# Altium schematic sheet HELIALights2022V1.0Sheet1.SchDoc: HELIA Lights
size A3; Author: Jeremias Pohle; CompanyName: CUER; DrawnBy: Jeremias Pohle; Engineer: Jeremias Pohle; Organization: University of Cambridge; Revision: 1.0; SheetNumber: 1; SheetTotal: 2
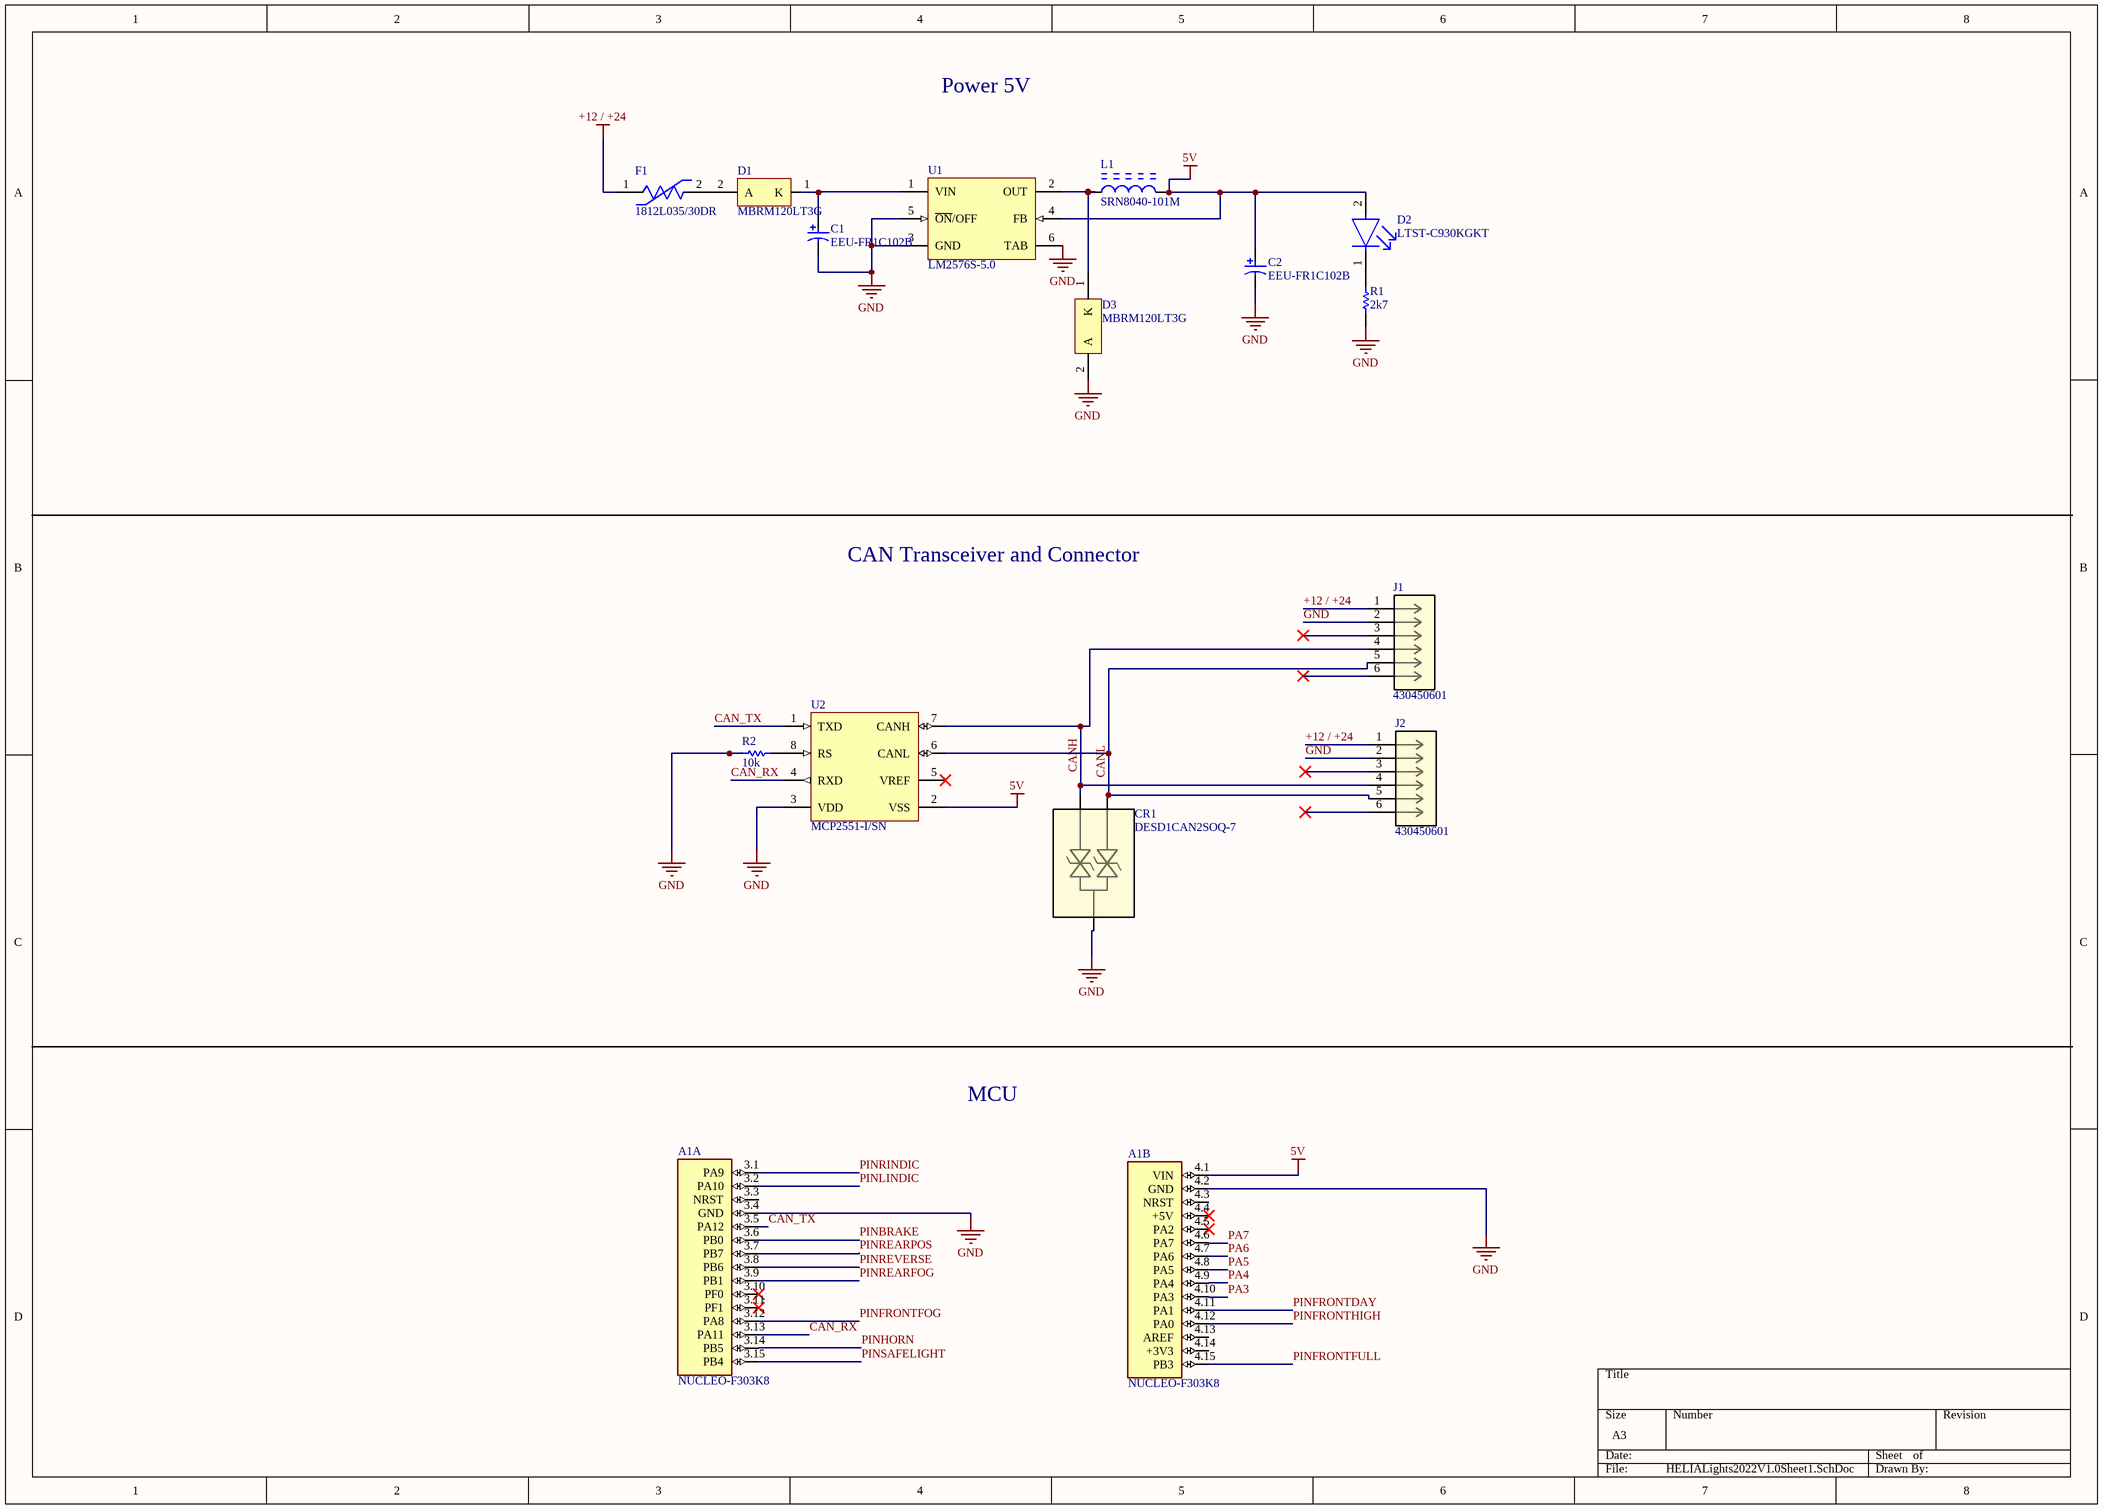
[diagram p0: HELIALights2022V1.0Sheet1.SchDoc]

## Parts
A1  NUCLEO-F303K8  [MODULE_NUCLEO-F303K8]  (parts A,B of 2)
C1  EEU-FR1C102B  [PNSC-EEUFM1H221-2]
C2  EEU-FR1C102B  [PNSC-EEUFM1H221-2]
CR1  DESD1CAN2SOQ-7  [DIODE3_DESD1CAN2SOQ-7_DIO]
D1  MBRM120LT3G  [ONSC-POWERMITE-2-457-04_D_V]
D2  LTST-C930KGKT  [FP-LTST-C930KGKT-MFG]
D3  MBRM120LT3G  [ONSC-POWERMITE-2-457-04_D_V]
F1  1812L035/30DR  [FP-1812L035-30DR-MFG]
J1  430450601  [CON_430450601_MOL]
J2  430450601  [CON_430450601_MOL]
L1  SRN8040-101M  [BOUR-SRN8040-101M_V]
R1  2k7  [RESC1609X50X30NL8T20]
R2  10k  [RESC1609X50X30NL8T20]
U1  LM2576S-5.0  [KTT0005B_N]
U2  MCP2551-I/SN  [MCHP-SN8_V]

## Nets
5V: A1.4.1(VIN) C2.1 D2.2(A) L1.2 U1.4(FB) U2.2(VSS)
+12 / +24: F1.1 J1.1 J2.1
GND: A1.3.4(GND) A1.4.2(GND) C1.2 C2.2 CR1.3 D3.2(A) J1.2 J2.2 R1.1 R2.2 U1.3(GND) U1.5(~{ON}/OFF) U1.6(TAB) U2.3(VDD)
CAN_RX: A1.3.13(PA11) U2.4(RXD)
CAN_TX: A1.3.5(PA12) U2.1(TXD)
CANH: CR1.2 J1.4 J2.4 U2.7(CANH)
CANL: CR1.1 J1.5 J2.5 U2.6(CANL)
PA3: A1.4.10(PA3)
PA4: A1.4.9(PA4)
PA5: A1.4.8(PA5)
PA6: A1.4.7(PA6)
PA7: A1.4.6(PA7)
PINBRAKE: A1.3.6(PB0)
PINFRONTDAY: A1.4.11(PA1)
PINFRONTFOG: A1.3.12(PA8)
PINFRONTFULL: A1.4.15(PB3)
PINFRONTHIGH: A1.4.12(PA0)
PINHORN: A1.3.14(PB5)
PINLINDIC: A1.3.2(PA10)
PINREARFOG: A1.3.9(PB1)
PINREARPOS: A1.3.7(PB7)
PINREVERSE: A1.3.8(PB6)
PINRINDIC: A1.3.1(PA9)
PINSAFELIGHT: A1.3.15(PB4)
NetC1_1: C1.1 D1.1(K) U1.1(VIN)
NetD1_2: D1.2(A) F1.2
NetD2_1: D2.1(C) R1.2
NetD3_1: D3.1(K) L1.1 U1.2(OUT)
NetR2_1: R2.1 U2.8(RS)

Not connected (* = marked no-connect by the designer): A1 3.3(NRST) 3.10(PF0)* 3.11(PF1)* 4.3(NRST) 4.4(+5V)* 4.5(PA2)* 4.13(AREF) 4.14(+3V3); J1 3* 6*; J2 3* 6*; U2 5(VREF)*

## Notes on the sheet
- Power 5V
- CAN Transceiver and Connector
- MCU

## Library data of the parts
A1 = NUCLEO-F303K8: STM32F303K8, mbed-Enabled Development Nucleo-32 STM32F3 ARMÂ® CortexÂ®-M4 MCU 32-Bit Embedded Evaluation Board; MF: STMicroelectronics; MP: NUCLEO-F303K8; SnapEDA_Link: https://www.snapeda.com/parts/NUCLEO-F303K8/STMicroelectronics/view-part/276791/?ref=snap; Availability: Unavailable; Package: None; Value: *; Price: None
C1 C2 = CMP-2000-05313-1: Aluminum Electrolytic Capacitor, 1000 uF, +/- 20%, 16 V, -40 to 105 degC, 2-Pin THD, RoHS, Tape and Reel; Manufacturer: Panasonic; Capacitance: 1000µF; Ripple Current: 1790mA; Rated Voltage: 16V; Impedance: 0.028O; Type: Radial; Lifetime@Temperature: 8000Hrs@105degC; Operating Temp-Max: 105degC; Operating Temp Range: -40to+105degC; Manufacturer URL: http://www.panasonic.com/; Datasheet URL: http://www.produktinfo.conrad.com/datenblaetter/425000-449999/446746-da-01-en-ALU_KONDENSATOR_FR_R_1000_UF_16V.pdf; Case Size/Dimension: Ø10x16mm; Datasheet Version: Nov-11; Series: FR
CR1 = DESD1CAN2SOQ-7: No Description Available; Mfr_Name: Diodes Inc; Type: DEV; Copyright: Copyright (C) 2022 Ultra Librarian. All rights reserved.; Manufacturer_Part_Number: DESD1CAN2SOQ-7; RefDes: RefDes
D1 D3 = CMP-1055-00263-1: Schottky Power Rectifier, 2-Pin Powermite, Pb-Free, Tape and Reel; PartNumber: MBRM120LT1G; Manufacturer: On Semiconductor; IFSM Max (A): 50; Configuration: Single; ComponentLink1Description: Manufacturer URL; ComponentLink3URL: http://www.onsemi.com/pub_link/Collateral/457-04.PDF; PackageDescription: 2-Pin POWERMITE, Body 1.965 x 1.9 mm; DatasheetVersion: Rev. 7; Mounting Technology: Surface Mount; ComponentLink1URL: http://www.onsemi.com/; PackageVersion: Rev. F, 05/2013; ComponentLink2Description: Datasheet; PackageReference: POWERMITE-2-457-04; RoHS: TRUE; Packing: Tape and Reel; ComponentLink2URL: http://www.onsemi.cn/pub_link/Collateral/MBRM120L-D.PDF; ComponentLink3Description: Package Specification
D2 = CMP-2000-06626-2: LED GREEN CLEAR CHIP SMD; Power Rating: 75mW; Lens Style: Diffused; Number of Elements: 1; Test Current: 20mA; Reverse Voltage: 5V; Lens Color: Colorless; Wavelength: 574nm; Viewing Angle: 25°; Forward Voltage: 2V; Luminous Intensity: 600mcd; Forward Current: 30mA; Dominant Wavelength: 571nm; Illumination Color: Green; Number of LEDs: 1; RoHS Compliant: Yes; Length: 3.2mm; Max Operating Temperature: 85°C; Height: 2.4mm; Lens Transparency: Clear; Series: -; Case/Package: 1209; Case Code (Metric): 3224; Depth: 2.4mm; Packaging: Tape and Reel; Number of Pins: 2; Package Quantity: 1; Case Code (Imperial): 1209; Radiation Hardening: No; Mount: Surface Mount; Power Dissipation: 75mW; Min Operating Temperature: -55°C; Lead Free: Lead Free; Voltage: 5V; Color: Green; Width: 2.4mm
F1 = CMP-08606-000005-1: PTC RESET FUSE 30V 350MA 1812; Manufacturer: Littelfuse Inc; Trip Time: 0.15s; Hold Current: 0.35A; Value: 0.4-1.7Ω; Trip Current: 0.75A; Current Rating: 40A; Temperature Range High: +85°C; Ambient Temperature Range High: +85°C; Device Class L2: PTC Resettable Fuses; RoHS: TRUE; Digikey Description: PTC RESET FUSE 30V 350MA 1812; ComponentLink2URL: https://www.littelfuse.com/~/media/electronics/datasheets/resettable_ptcs/littelfuse_ptc_1812l_datasheet.pdf.pdf; Lead Free: Yes; Ambient Temperature Range Low: -40°C; Manufacturer Part Number: 1812L035/30DR; Automotive: No; Category: Fuse; Octopart: https://octopart.com/1812l035%2F30dr-littelfuse-19645438; Device Class L3: unset; Device Class L1: Circuit Protection; Temperature Range Low: -40°C; Mouser Description: Resettable Fuses - PPTC PTC 30V POLY 1812 HALOGEN-FREE .35A; Package: 0; Voltage Rating: 30V; ComponentLink2Description: Datasheet; Temperature: -40°C to +85°C; Resistance: 0.4-1.7Ω; Height: 1.25mm
J1 J2 = 430450601: No Description Available; Mfr_Name: Molex Connector Corporation; Copyright: Copyright (C) 2022 Ultra Librarian. All rights reserved.; Manufacturer_Part_Number: 430450601; RefDes: RefDes; Type: DEV
L1 = CMP-2000-07143-1: Semi-Shielded Power Inductor, 100 uH, -40 to 125 degC, 2-Pin SMD, RoHS, Tape and Reel; Manufacturer: Bourns; Tolerance: ±20 / %; Brand/Series: SRN8040Series; Current, Rating: 1 / A; Inductance: 100 / µH; Manufacturer URL: http://www.bourns.com/; Package Description: 2-Pin Surface Mount Device, Body 8 x 8 mm; Datasheet URL: http://www.produktinfo.conrad.com/datenblaetter/1000000-1099999/001056456-da-01-en-MAG_ABG_LEIST_IND_SRN8040_101M_100UH_SMD.pdf; Datasheet Version: 08/2013; Termination: SMT; Type: Power; Mounting Technology: SurfaceMount; Package Reference: SRN8040-101M
R1 R2 = CMP-2000-03816-5: Chip Resistor, 0 Ohm, Jumper, 100 mW, -55 to 155 degC, 0603 (1608 Metric), RoHS, Tape and Reel; Manufacturer: Vishay Semiconductor; Voltage Rating: 75 V; Package Quantity: 5000; DatasheetVersion: 06/2012; Min Operating Temperature: -55 degC; ComponentLink1URL: http://www.vishay.com/; Mounting Technology: Surface Mount; Height: 0.45 mm; ComponentLink1Description: Manufacturer URL; REACH SVHC: Unknown; PackageReference: 0603; Packaging: Tape and Reel; Max Operating Temperature: 155 degC; Mount: Surface Mount; ComponentLink2Description: Datasheet; PackageDescription: 2-Pin Surface Mount Device, Body 1.575 x 0.85 mm; Length: 1.55 mm; ComponentLink2URL: http://www.vishay.com/docs/20035/dcrcwe3.pdf; Pins: 2; RoHSCompliant: true
U1 = CMP-0069-00115-3: SIMPLE SWITCHER® 3A Step-Down Voltage Regulator, 5-pin TO-263; Manufacturer: Texas Instruments; PackageTopMarking: NSUZXYTTE#*LM2576S*-5.0 P+; PowerWise: N; ComponentLink1Description: Datasheet URL; CompType: Switcher; PinCount: 5; Code_JEDEC: MO-169-AB; PackageDescription: TO-263, Molded, .400 x .390 x .180in, 5 Lead, .067in Pitch, Surface Mount; ComponentLink1URL: http://www.ti.com/general/docs/lit/getliterature.tsp?genericPartNumber=LM2576&fileType=pdf; RoHS: N; PackageReference: KTT0005B
U2 = CMP-0186-00138-3: High-Speed CAN Transceiver, / 1 Mb/s, 4.5 to 5.5 V, 8-Pin SOIC (SN), Industrial Temperature, RoHS, Tube; Manufacturer: Microchip; RoHSCompliant: true; PackageReference: SN8; ComponentLink1URL: http://www.microchip.com/; DatasheetVersion: Rev. F, 07/2010; ComponentLink2Description: Datasheet; ComponentLink2URL: http://ww1.microchip.com/downloads/en/DeviceDoc/21667f.pdf; ComponentLink3Description: Package Specification; PackageDescription: 8-Pin Small Outline Integrated Circuit, Body 4.9 x 3.9 mm, Pitch 1.27 mm; ComponentLink1Description: Manufacturer URL; Mounting Technology: Surface Mount; ComponentLink3URL: http://www.microchip.com/stellent/groups/techpub_sg/documents/packagingspec/en012702.pdf